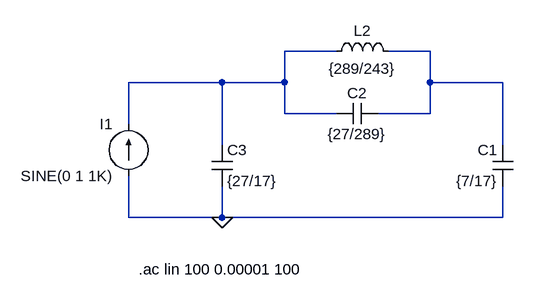
[diagram p0: schematic Ej2.asc]
Ej2.asc, the LTspice schematic file:
Version 4
SHEET 1 880 680
WIRE 400 208 320 208
WIRE 544 208 480 208
WIRE 224 256 80 256
WIRE 320 256 320 208
WIRE 320 256 224 256
WIRE 544 256 544 208
WIRE 656 256 544 256
WIRE 320 304 320 256
WIRE 400 304 320 304
WIRE 544 304 544 256
WIRE 544 304 464 304
WIRE 80 320 80 256
WIRE 224 352 224 256
WIRE 656 352 656 256
WIRE 80 464 80 400
WIRE 224 464 224 416
WIRE 224 464 80 464
WIRE 656 464 656 416
WIRE 656 464 224 464
FLAG 224 464 0
SYMBOL cap 208 352 R0
SYMATTR InstName C3
SYMATTR Value {27/17}
SYMBOL Cap 464 288 R90
WINDOW 0 0 32 VBottom 2
WINDOW 3 32 32 VTop 2
SYMATTR InstName C2
SYMATTR Value {27/289}
SYMBOL Cap 672 416 R180
WINDOW 0 24 56 Left 2
WINDOW 3 24 8 Left 2
SYMATTR InstName C1
SYMATTR Value {7/17}
SYMBOL Ind 384 224 R270
WINDOW 0 32 56 VTop 2
WINDOW 3 5 56 VBottom 2
SYMATTR InstName L2
SYMATTR Value {289/243}
SYMBOL current 80 400 R180
WINDOW 0 24 80 Left 2
WINDOW 3 24 0 Left 2
SYMATTR InstName I1
SYMATTR Value SINE(0 1 1K)
SYMATTR Value2 AC 1
TEXT 96 544 Left 2 !.ac lin 100 0.00001 100

The netlist it stands for:
* Ej2.asc
C3 N001 0 {27/17}
C2 N002 N001 {27/289}
C1 0 N002 {7/17}
L2 N001 N002 {289/243}
I1 0 N001 SINE(0 1 1K) AC 1
.ac lin 100 0.00001 100
.backanno
.end